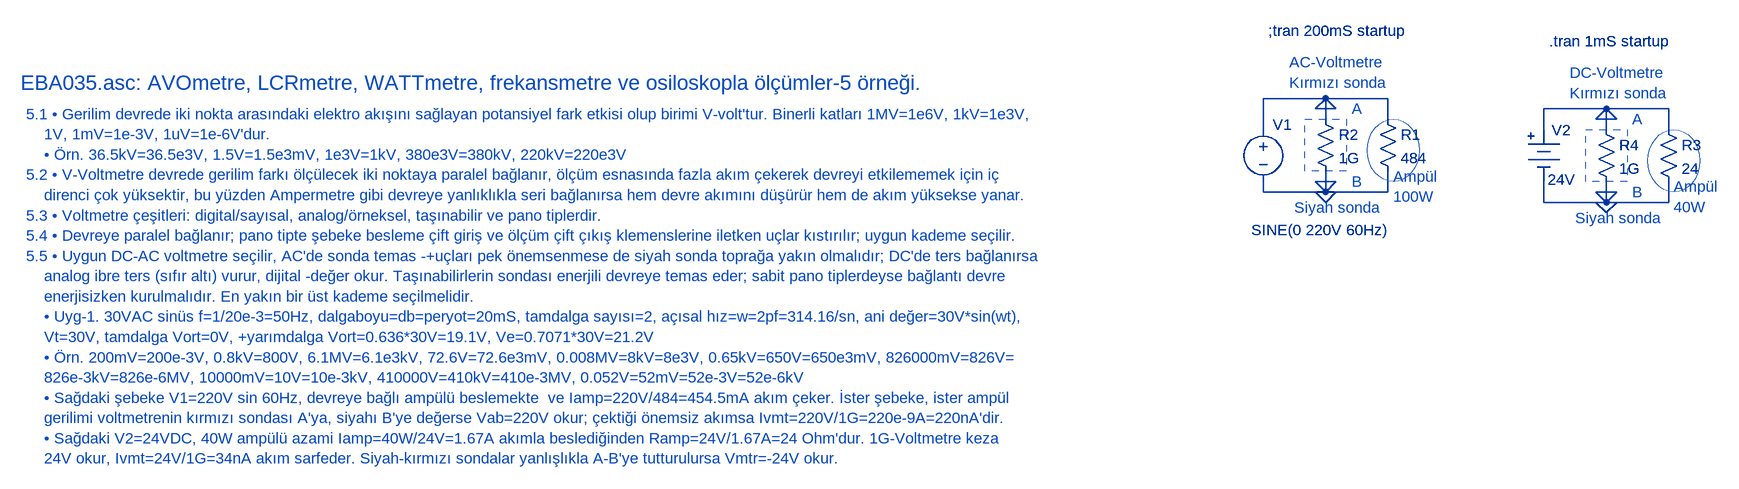
[diagram p0: schematic EBA035.asc]
EBA035.asc, the LTspice schematic file:
Version 4
SHEET 1 3956 2064
WIRE 1856 64 1760 64
WIRE 1952 64 1856 64
WIRE 1840 80 1856 64
WIRE 1872 80 1856 64
WIRE 1872 80 1840 80
WIRE 2288 80 2192 80
WIRE 2384 80 2288 80
WIRE 1856 96 1856 64
WIRE 1952 96 1952 64
WIRE 2272 96 2288 80
WIRE 2304 96 2288 80
WIRE 2304 96 2272 96
WIRE 1760 112 1760 64
WIRE 2192 112 2192 80
WIRE 2288 112 2288 80
WIRE 2384 112 2384 80
WIRE 1872 192 1840 192
WIRE 1760 208 1760 192
WIRE 1856 208 1856 176
WIRE 1856 208 1840 192
WIRE 1856 208 1872 192
WIRE 1856 208 1760 208
WIRE 1952 208 1952 176
WIRE 1952 208 1856 208
WIRE 2304 208 2272 208
WIRE 2192 224 2192 192
WIRE 2288 224 2288 192
WIRE 2288 224 2272 208
WIRE 2288 224 2304 208
WIRE 2288 224 2192 224
WIRE 2384 224 2384 192
WIRE 2384 224 2288 224
FLAG 1856 208 0
FLAG 2288 224 0
SYMBOL voltage 1760 96 R0
WINDOW 3 -18 171 Left 2
WINDOW 123 0 0 Left 0
WINDOW 39 -36 159 Left 2
WINDOW 0 15 8 Left 2
SYMATTR Value SINE(0 220V 60Hz)
SYMATTR InstName V1
SYMBOL res 1936 80 R0
SYMATTR InstName R1
SYMATTR Value 484
SYMBOL res 1840 80 R0
SYMATTR InstName R2
SYMATTR Value 1G
SYMBOL res 2368 96 R0
SYMATTR InstName R3
SYMATTR Value 24
SYMBOL res 2272 96 R0
SYMATTR InstName R4
SYMATTR Value 1G
SYMBOL Misc\\battery 2192 96 R0
WINDOW 0 12 17 Left 2
WINDOW 3 6 93 Left 2
SYMATTR InstName V2
SYMATTR Value 24V
TEXT -152 40 Left 3 ;EBA035.asc: AVOmetre, LCRmetre, WATTmetre, frekansmetre ve osiloskopla ölçümler-5 örneği.
TEXT -144 88 Left 2 ;5.1 • Gerilim devrede iki nokta arasındaki elektro akışını sağlayan potansiyel fark etkisi olup birimi V-volt'tur. Binerli katları 1MV=1e6V, 1kV=1e3V,\n    1V, 1mV=1e-3V, 1uV=1e-6V'dur.\n    • Örn. 36.5kV=36.5e3V, 1.5V=1.5e3mV, 1e3V=1kV, 380e3V=380kV, 220kV=220e3V\n5.2 • V-Voltmetre devrede gerilim farkı ölçülecek iki noktaya paralel bağlanır, ölçüm esnasında fazla akım çekerek devreyi etkilememek için iç\n    direnci çok yüksektir, bu yüzden Ampermetre gibi devreye yanlıklıkla seri bağlanırsa hem devre akımını düşürür hem de akım yüksekse yanar.\n5.3 • Voltmetre çeşitleri: digital/sayısal, analog/örneksel, taşınabilir ve pano tiplerdir.\n5.4 • Devreye paralel bağlanır; pano tipte şebeke besleme çift giriş ve ölçüm çift çıkış klemenslerine iletken uçlar kıstırılır; uygun kademe seçilir.\n5.5 • Uygun DC-AC voltmetre seçilir, AC'de sonda temas -+uçları pek önemsenmese de siyah sonda toprağa yakın olmalıdır; DC'de ters bağlanırsa\n    analog ibre ters (sıfır altı) vurur, dijital -değer okur. Taşınabilirlerin sondası enerjili devreye temas eder; sabit pano tiplerdeyse bağlantı devre\n    enerjisizken kurulmalıdır. En yakın bir üst kademe seçilmelidir.\n    • Uyg-1. 30VAC sinüs f=1/20e-3=50Hz, dalgaboyu=db=peryot=20mS, tamdalga sayısı=2, açısal hız=w=2pf=314.16/sn, ani değer=30V*sin(wt),\n    Vt=30V, tamdalga Vort=0V, +yarımdalga Vort=0.636*30V=19.1V, Ve=0.7071*30V=21.2V\n    • Örn. 200mV=200e-3V, 0.8kV=800V, 6.1MV=6.1e3kV, 72.6V=72.6e3mV, 0.008MV=8kV=8e3V, 0.65kV=650V=650e3mV, 826000mV=826V=\n    826e-3kV=826e-6MV, 10000mV=10V=10e-3kV, 410000V=410kV=410e-3MV, 0.052V=52mV=52e-3V=52e-6kV\n    • Sağdaki şebeke V1=220V sin 60Hz, devreye bağlı ampülü beslemekte  ve Iamp=220V/484=454.5mA akım çeker. İster şebeke, ister ampül \n    gerilimi voltmetrenin kırmızı sondası A'ya, siyahı B'ye değerse Vab=220V okur; çektiği önemsiz akımsa Ivmt=220V/1G=220e-9A=220nA'dir.\n    • Sağdaki V2=24VDC, 40W ampülü azami Iamp=40W/24V=1.67A akımla beslediğinden Ramp=24V/1.67A=24 Ohm'dur. 1G-Voltmetre keza\n    24V okur, Ivmt=24V/1G=34nA akım sarfeder. Siyah-kırmızı sondalar yanlışlıkla A-B'ye tutturulursa Vmtr=-24V okur.
TEXT 1800 8 Left 2 ;AC-Voltmetre
TEXT 1768 -40 Left 2 !;tran 200mS startup
TEXT 1800 40 Left 2 ;Kırmızı sonda
TEXT 1808 232 Left 2 ;Siyah sonda
TEXT 1896 80 Left 2 ;A
TEXT 1896 192 Left 2 ;B
TEXT 1960 184 Left 2 ;Ampül\n100W
TEXT 2232 24 Left 2 ;DC-Voltmetre
TEXT 2200 -24 Left 2 !.tran 1mS startup
TEXT 2232 56 Left 2 ;Kırmızı sonda
TEXT 2240 248 Left 2 ;Siyah sonda
TEXT 2328 96 Left 2 ;A
TEXT 2328 208 Left 2 ;B
TEXT 2392 200 Left 2 ;Ampül\n40W
RECTANGLE Normal 1888 176 1824 96 2
RECTANGLE Normal 2320 192 2256 112 2
CIRCLE Normal 2000 192 1920 96 2
CIRCLE Normal 2432 208 2352 112 2

The netlist it stands for:
* EBA035.asc
V1 N001 0 SINE(0 220V 60Hz)
R1 N001 0 484
R2 N001 0 1G
R3 N002 0 24
R4 N002 0 1G
V2 N002 0 24V
* EBA035.asc: AVOmetre, LCRmetre, WATTmetre, frekansmetre ve osiloskopla ölçümler-5 örneği.
* 5.1 • Gerilim devrede iki nokta arasındaki elektro akışını sağlayan potansiyel fark etkisi olup birimi V-volt'tur. Binerli katları 1MV=1e6V, 1kV=1e3V,
*     1V, 1mV=1e-3V, 1uV=1e-6V'dur.
*     • Örn. 36.5kV=36.5e3V, 1.5V=1.5e3mV, 1e3V=1kV, 380e3V=380kV, 220kV=220e3V
* 5.2 • V-Voltmetre devrede gerilim farkı ölçülecek iki noktaya paralel bağlanır, ölçüm esnasında fazla akım çekerek devreyi etkilememek için iç
*     direnci çok yüksektir, bu yüzden Ampermetre gibi devreye yanlıklıkla seri bağlanırsa hem devre akımını düşürür hem de akım yüksekse yanar.
* 5.3 • Voltmetre çeşitleri: digital/sayısal, analog/örneksel, taşınabilir ve pano tiplerdir.
* 5.4 • Devreye paralel bağlanır; pano tipte şebeke besleme çift giriş ve ölçüm çift çıkış klemenslerine iletken uçlar kıstırılır; uygun kademe seçilir.
* 5.5 • Uygun DC-AC voltmetre seçilir, AC'de sonda temas -+uçları pek önemsenmese de siyah sonda toprağa yakın olmalıdır; DC'de ters bağlanırsa
*     analog ibre ters (sıfır altı) vurur, dijital -değer okur. Taşınabilirlerin sondası enerjili devreye temas eder; sabit pano tiplerdeyse bağlantı devre
*     enerjisizken kurulmalıdır. En yakın bir üst kademe seçilmelidir.
*     • Uyg-1. 30VAC sinüs f=1/20e-3=50Hz, dalgaboyu=db=peryot=20mS, tamdalga sayısı=2, açısal hız=w=2pf=314.16/sn, ani değer=30V*sin(wt),
*     Vt=30V, tamdalga Vort=0V, +yarımdalga Vort=0.636*30V=19.1V, Ve=0.7071*30V=21.2V
*     • Örn. 200mV=200e-3V, 0.8kV=800V, 6.1MV=6.1e3kV, 72.6V=72.6e3mV, 0.008MV=8kV=8e3V, 0.65kV=650V=650e3mV, 826000mV=826V=
*     826e-3kV=826e-6MV, 10000mV=10V=10e-3kV, 410000V=410kV=410e-3MV, 0.052V=52mV=52e-3V=52e-6kV
*     • Sağdaki şebeke V1=220V sin 60Hz, devreye bağlı ampülü beslemekte  ve Iamp=220V/484=454.5mA akım çeker. İster şebeke, ister ampül
*     gerilimi voltmetrenin kırmızı sondası A'ya, siyahı B'ye değerse Vab=220V okur; çektiği önemsiz akımsa Ivmt=220V/1G=220e-9A=220nA'dir.
*     • Sağdaki V2=24VDC, 40W ampülü azami Iamp=40W/24V=1.67A akımla beslediğinden Ramp=24V/1.67A=24 Ohm'dur. 1G-Voltmetre keza
*     24V okur, Ivmt=24V/1G=34nA akım sarfeder. Siyah-kırmızı sondalar yanlışlıkla A-B'ye tutturulursa Vmtr=-24V okur.
* AC-Voltmetre
;tran 200mS startup
* Kırmızı sonda
* Siyah sonda
* A
* B
* Ampül
* 100W
* DC-Voltmetre
.tran 1mS startup
* Kırmızı sonda
* Siyah sonda
* A
* B
* Ampül
* 40W
.backanno
.end